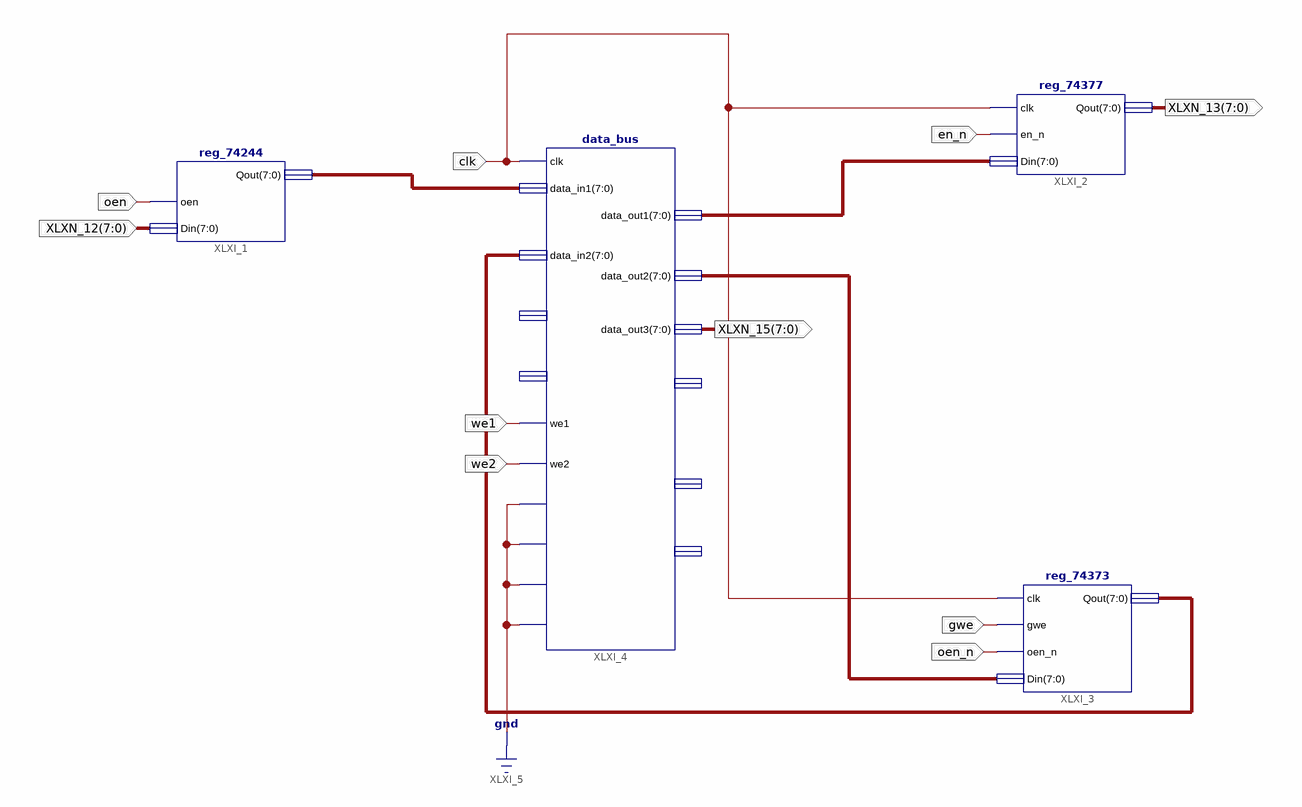
[diagram p0: schematic sheet 1]
// Xilinx ISE schematic pro11.sch (spartan6) as structural Verilog: 4 symbols, 10 ports
module pro11 (
  input  clk,
  input  we1,
  input  we2,
  input  oen,
  input  [7:0] XLXN_12,
  input  en_n,
  input  gwe,
  input  oen_n,
  output [7:0] XLXN_13,
  output [7:0] XLXN_15
);

  wire [7:0] XLXN_1, XLXN_4, XLXN_5, XLXN_7;

  reg_74244 XLXI_1 (.oen(oen), .Din(XLXN_12), .Qout(XLXN_1));
  reg_74377 XLXI_2 (.clk(clk), .en_n(en_n), .Din(XLXN_4), .Qout(XLXN_13));
  reg_74373 XLXI_3 (.clk(clk), .gwe(gwe), .oen_n(oen_n), .Din(XLXN_5), .Qout(XLXN_7));
  data_bus XLXI_4 (
    .clk(clk), .data_in1(XLXN_1), .data_out3(XLXN_15), .data_out2(XLXN_5), .data_out1(XLXN_4), .we_io2(1'b0),
    .we_io1(1'b0), .we4(1'b0), .we3(1'b0), .data_in2(XLXN_7), .we2(we2), .we1(we1));  // open: data_out4, data_in3, data_in4, data_io2, data_io1
endmodule
